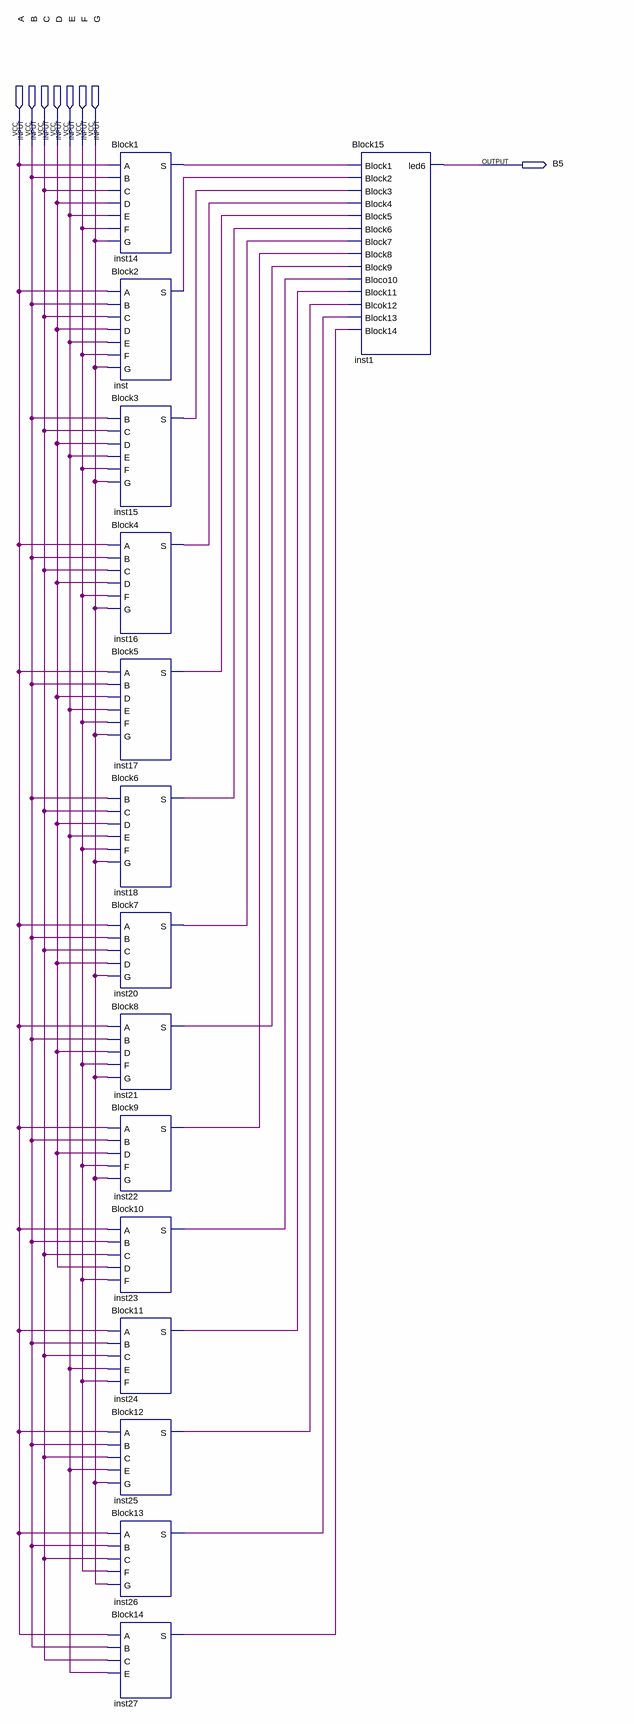
[diagram p0: schematic sheet]
// Quartus schematic posicao1.bdf as structural Verilog: 15 symbols, 8 pins
module posicao1 (
  input  A,
  input  B,
  input  C,
  input  D,
  input  E,
  input  F,
  input  G,
  output B5
);

  wire inst14_s, inst15_s, inst16_s, inst17_s, inst18_s, inst20_s, inst21_s, inst22_s, inst23_s, inst24_s,
       inst25_s, inst26_s, inst27_s, inst_s;

  Block1 inst14 (.A(A), .B(B), .C(C), .D(D), .E(E), .F(F), .G(G), .S(inst14_s));
  Block2 inst (.A(A), .B(B), .C(C), .D(D), .E(E), .F(F), .G(G), .S(inst_s));
  Block3 inst15 (.B(B), .C(C), .D(D), .E(E), .F(F), .G(G), .S(inst15_s));
  Block4 inst16 (.A(A), .B(B), .C(C), .D(D), .F(F), .G(G), .S(inst16_s));
  Block5 inst17 (.A(A), .B(B), .D(D), .E(E), .F(F), .G(G), .S(inst17_s));
  Block6 inst18 (.B(B), .C(C), .D(D), .E(E), .F(F), .G(G), .S(inst18_s));
  Block7 inst20 (.A(A), .B(B), .C(C), .D(D), .G(G), .S(inst20_s));
  Block8 inst21 (.A(A), .B(B), .D(D), .F(F), .G(G), .S(inst21_s));
  Block9 inst22 (.A(A), .B(B), .D(D), .F(F), .G(G), .S(inst22_s));
  Block10 inst23 (.A(A), .B(B), .C(C), .D(D), .F(F), .S(inst23_s));
  Block11 inst24 (.A(A), .B(B), .C(C), .E(E), .F(F), .S(inst24_s));
  Block12 inst25 (.A(A), .B(B), .C(C), .E(E), .G(G), .S(inst25_s));
  Block13 inst26 (.A(A), .B(B), .C(C), .F(F), .G(G), .S(inst26_s));
  Block14 inst27 (.A(A), .B(B), .C(C), .E(E), .S(inst27_s));
  Block15 inst1 (
    .Block1(inst14_s), .Block2(inst_s), .Block3(inst15_s), .Block4(inst16_s), .Block5(inst17_s),
    .Block6(inst18_s), .Block7(inst20_s), .Block8(inst22_s), .Block9(inst21_s), .Bloco10(inst23_s),
    .Block11(inst24_s), .Blcok12(inst25_s), .Block13(inst26_s), .Block14(inst27_s), .led6(B5));
endmodule
